# Altium schematic sheet TK511_DC-PSU.SchDoc
size A4; DocumentNumber: 3; SheetNumber: 3; SheetTotal: 8
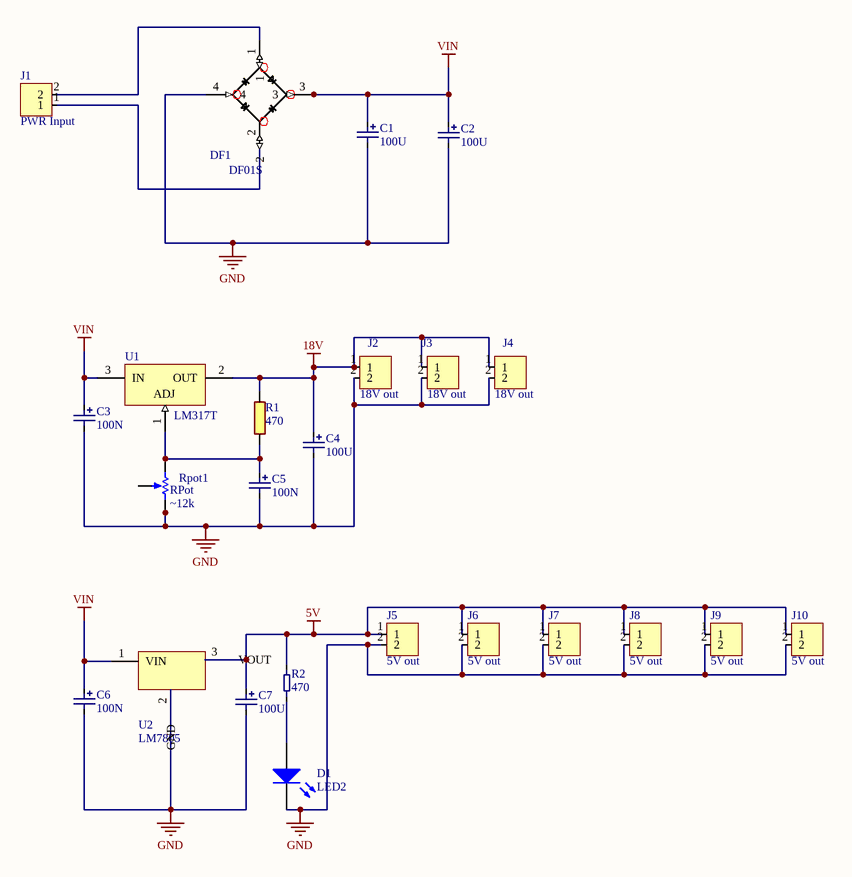
[diagram p0: TK511_DC-PSU.SchDoc]

## Parts
C1  100U  [CAP 2.5mm]
C2  100U  [CAP 2.5mm]
C3  100N  [RAD-0.2]
C4  100U  [CAP 2.5mm]
C5  100N  [RAD-0.2]
C6  100N  [RAD-0.2]
C7  100U  [CAP 2.5mm]
D1  LED2  [6-0805_L]
DF1  DF01S  [DF01S_PCB]
J1  PWR Input  [JST 2pin]
J2  18V out  [JST 2pin]
J3  18V out  [JST 2pin]
J4  18V out  [JST 2pin]
J5  5V out  [JST 2pin]
J6  5V out  [JST 2pin]
J7  5V out  [JST 2pin]
J8  5V out  [JST 2pin]
J9  5V out  [JST 2pin]
J10  5V out  [JST 2pin]
R1  470  [RESA_0.25W]
R2  470  [6-0805_N]
Rpot1  RPot  value ~12k  [VR5]
U1  LM317T  [221A-06]
U2  LM7805  [221A-06]

## Nets
5V: C7.2 J5.1 J6.1 J7.1 J8.1 J9.1 J10.1 R2.2 U2.3(VOUT)
18V: C4.2 J2.1 J3.1 J4.1 R1.2 U1.2(OUT)
GND: C1.1 C2.1 C3.1 C4.1 C5.1 C6.1 C7.1 D1.2(K) DF1.4 J2.2 J3.2 J4.2 J5.2 J6.2 J7.2 J8.2 J9.2 J10.2 Rpot1.2(BOT) U2.2(GND)
VIN: C1.2 C2.2 C3.2 C6.2 DF1.3 U1.3(IN) U2.1(VIN)
NetC5_2: C5.2 R1.1 Rpot1.1(TOP) U1.1(ADJ)
NetD1_1: D1.1(A) R2.1
NetDF1_1: DF1.1 J1.2
NetDF1_2: DF1.2 J1.1

Not connected (* = marked no-connect by the designer): Rpot1 3(TAP)

## Library data of the parts
C1-C7 = CAP
D1 = LED2: Typical RED, GREEN, YELLOW, AMBER GaAs LED; Published: 8-Jun-2000; LatestRevisionDate: 17-Jul-2002; LatestRevisionNote: Re-released for DXP Platform.; PackageVersion: Feb-2002; PackageReference: 3.2X1.6X1.1; Publisher: Altium Limited; PackageDescription: SM LED; 2 Flat Leads
DF1 = DF01S: Likeretterbro
J1-J10 = JST 2pin
R1 = 2799: 0.25W 1% Generic resistor; id: 2799; rad: 4; rom: OV; lager_type: Fremlager; dybde: 0; hylle: 8; antall: 100; kolonne: 1; pakke_opprettet_av: 815; symbol_opprettet_av: oystesm; nokkelord: Motstand, Resistor; pakketype: 92; pakke_opprettet: 28.06.2014 17:13:33; symbol_opprettet: 08.07.2014 21:16:33; navn: 470; pris: 0
R2 = R: Value: 10R
Rpot1 = RPot: Potentiometer; Sim Note: Enter the Resistance value and the set point into parameter fields.; Set Position: 0.5; Published: 8-Jun-2000; LatestRevisionDate: 17-Jul-2002; LatestRevisionNote: Re-released for DXP Platform.; PackageReference: VR5; Publisher: Altium Limited; PackageDescription: Variable Resistor, Thru-Hole; 3 Leads
U1 = LM317T: Three-Terminal Adjustable Output Positive Voltage Regulator; Note: Heatsink surface connected to Pin 2; Published: 15-Apr-2002; DatasheetVersion: 1996; PackageVersion: 1997; PackageReference: 221A-06; Publisher: Altium Limited; PackageDescription: TO, Thru-Hole, Vertical, Heatsink Mounted; 3 In-Line Leads; Pitch 2.54 mm; Code_JEDEC: TO-262-AA; ComponentLink1Description: Manufacturer Link; ComponentLink1URL: http://www.onsemi.com/site/products/taxonomy/0,4438,503,00.html; ComponentLink2Description: Datasheet; ComponentLink2URL: http://www.onsemi.com/pub/Collateral/LM317-D.PDF